# EasyEDA Pro project ProPrj_fallctf2025badge_2025-09-24.epro, board PCB20
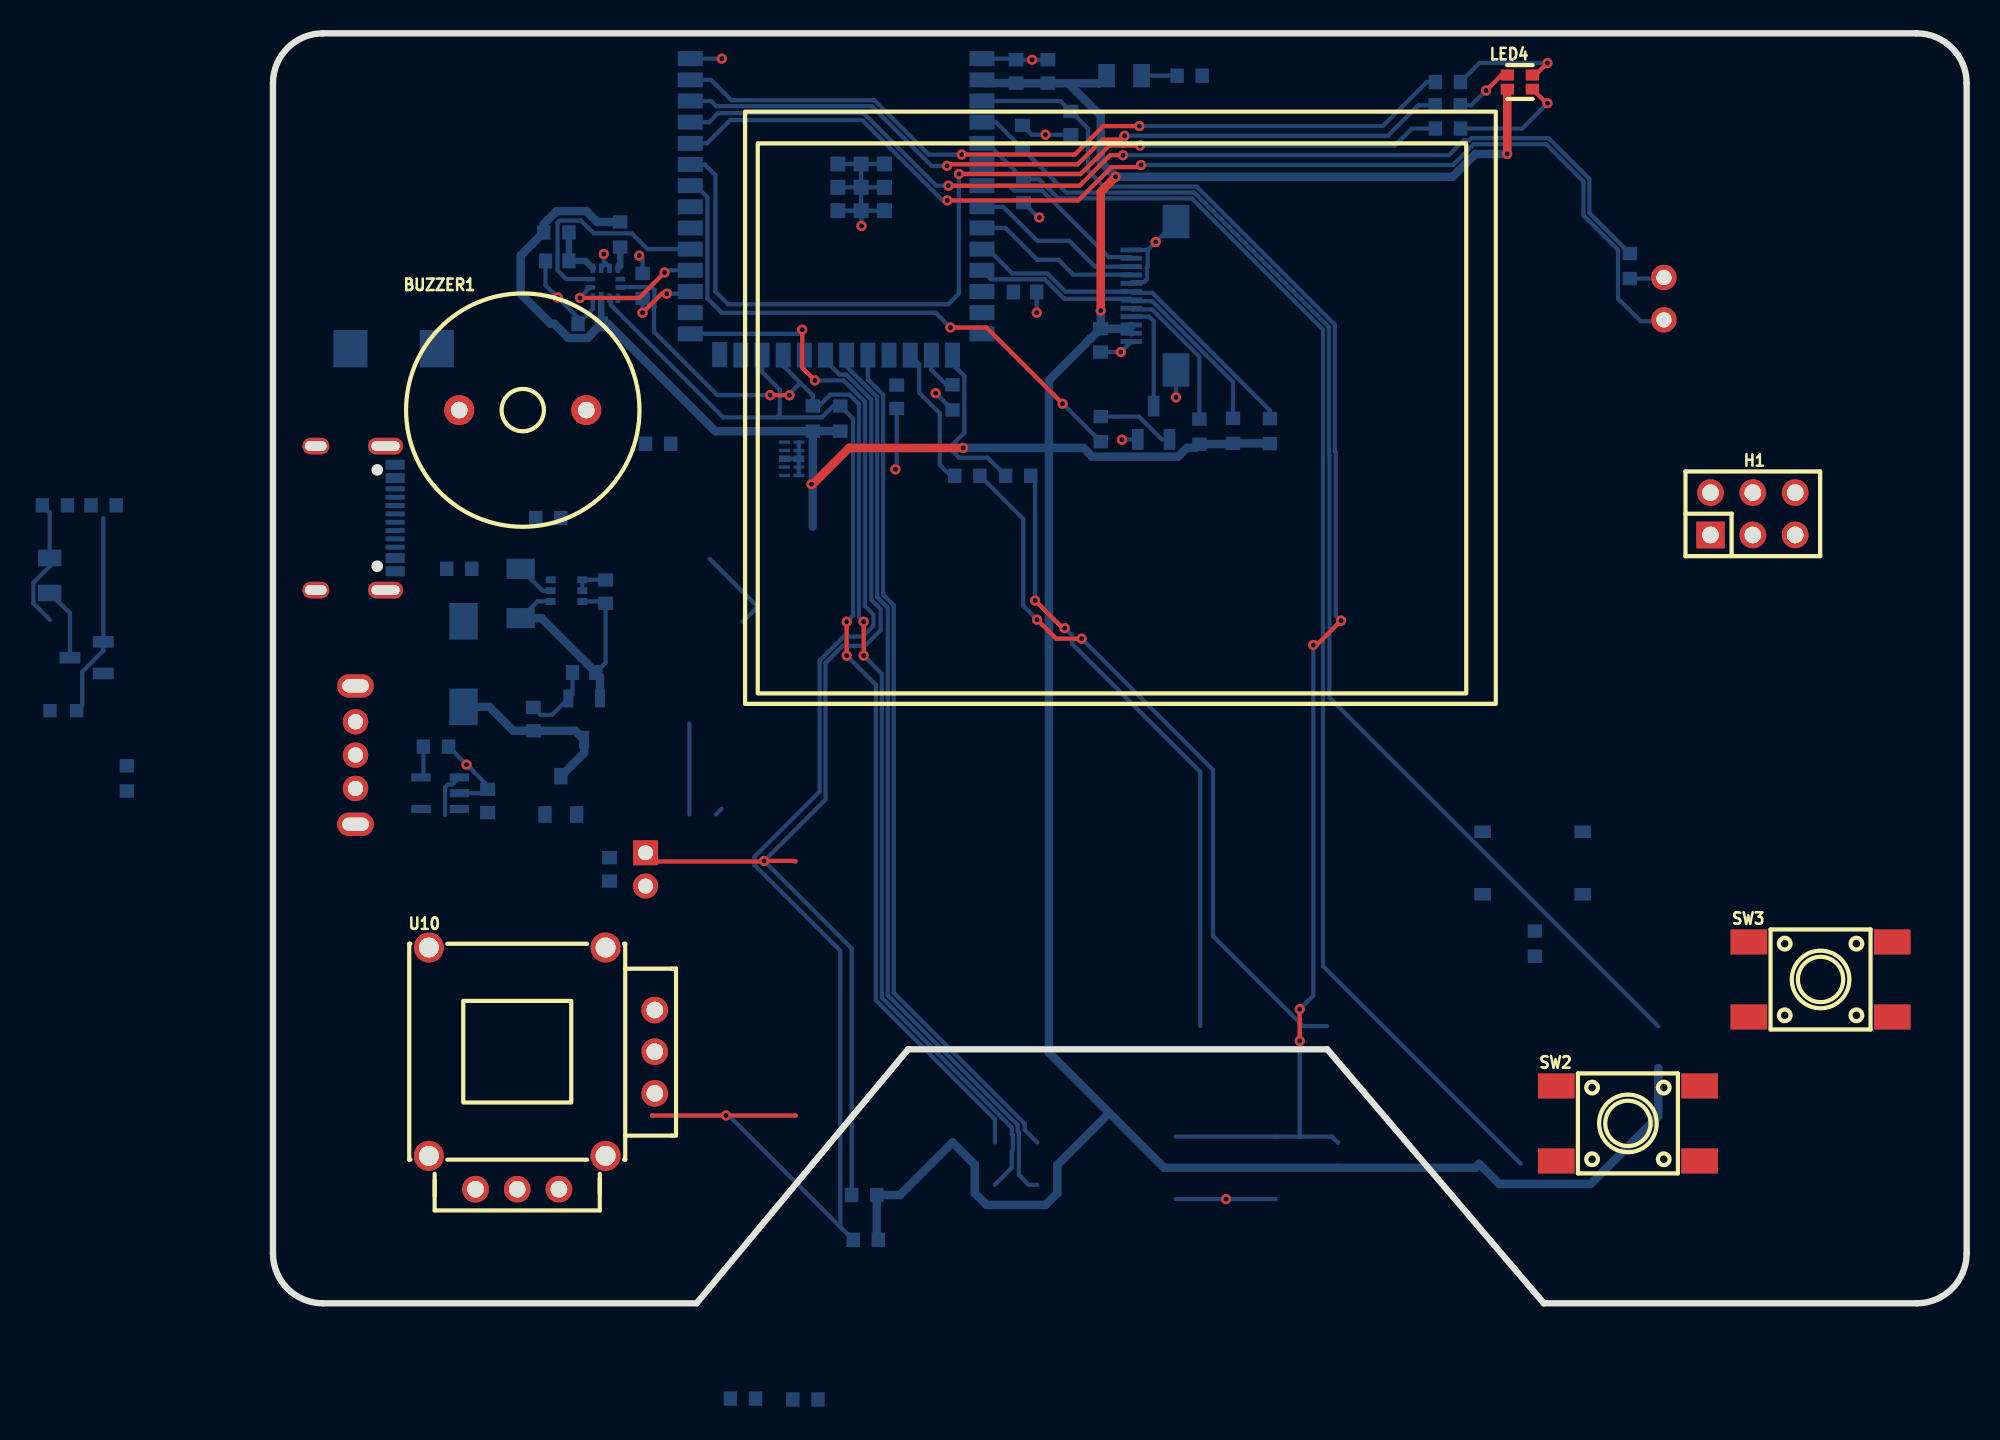
[diagram p15: board, top side]
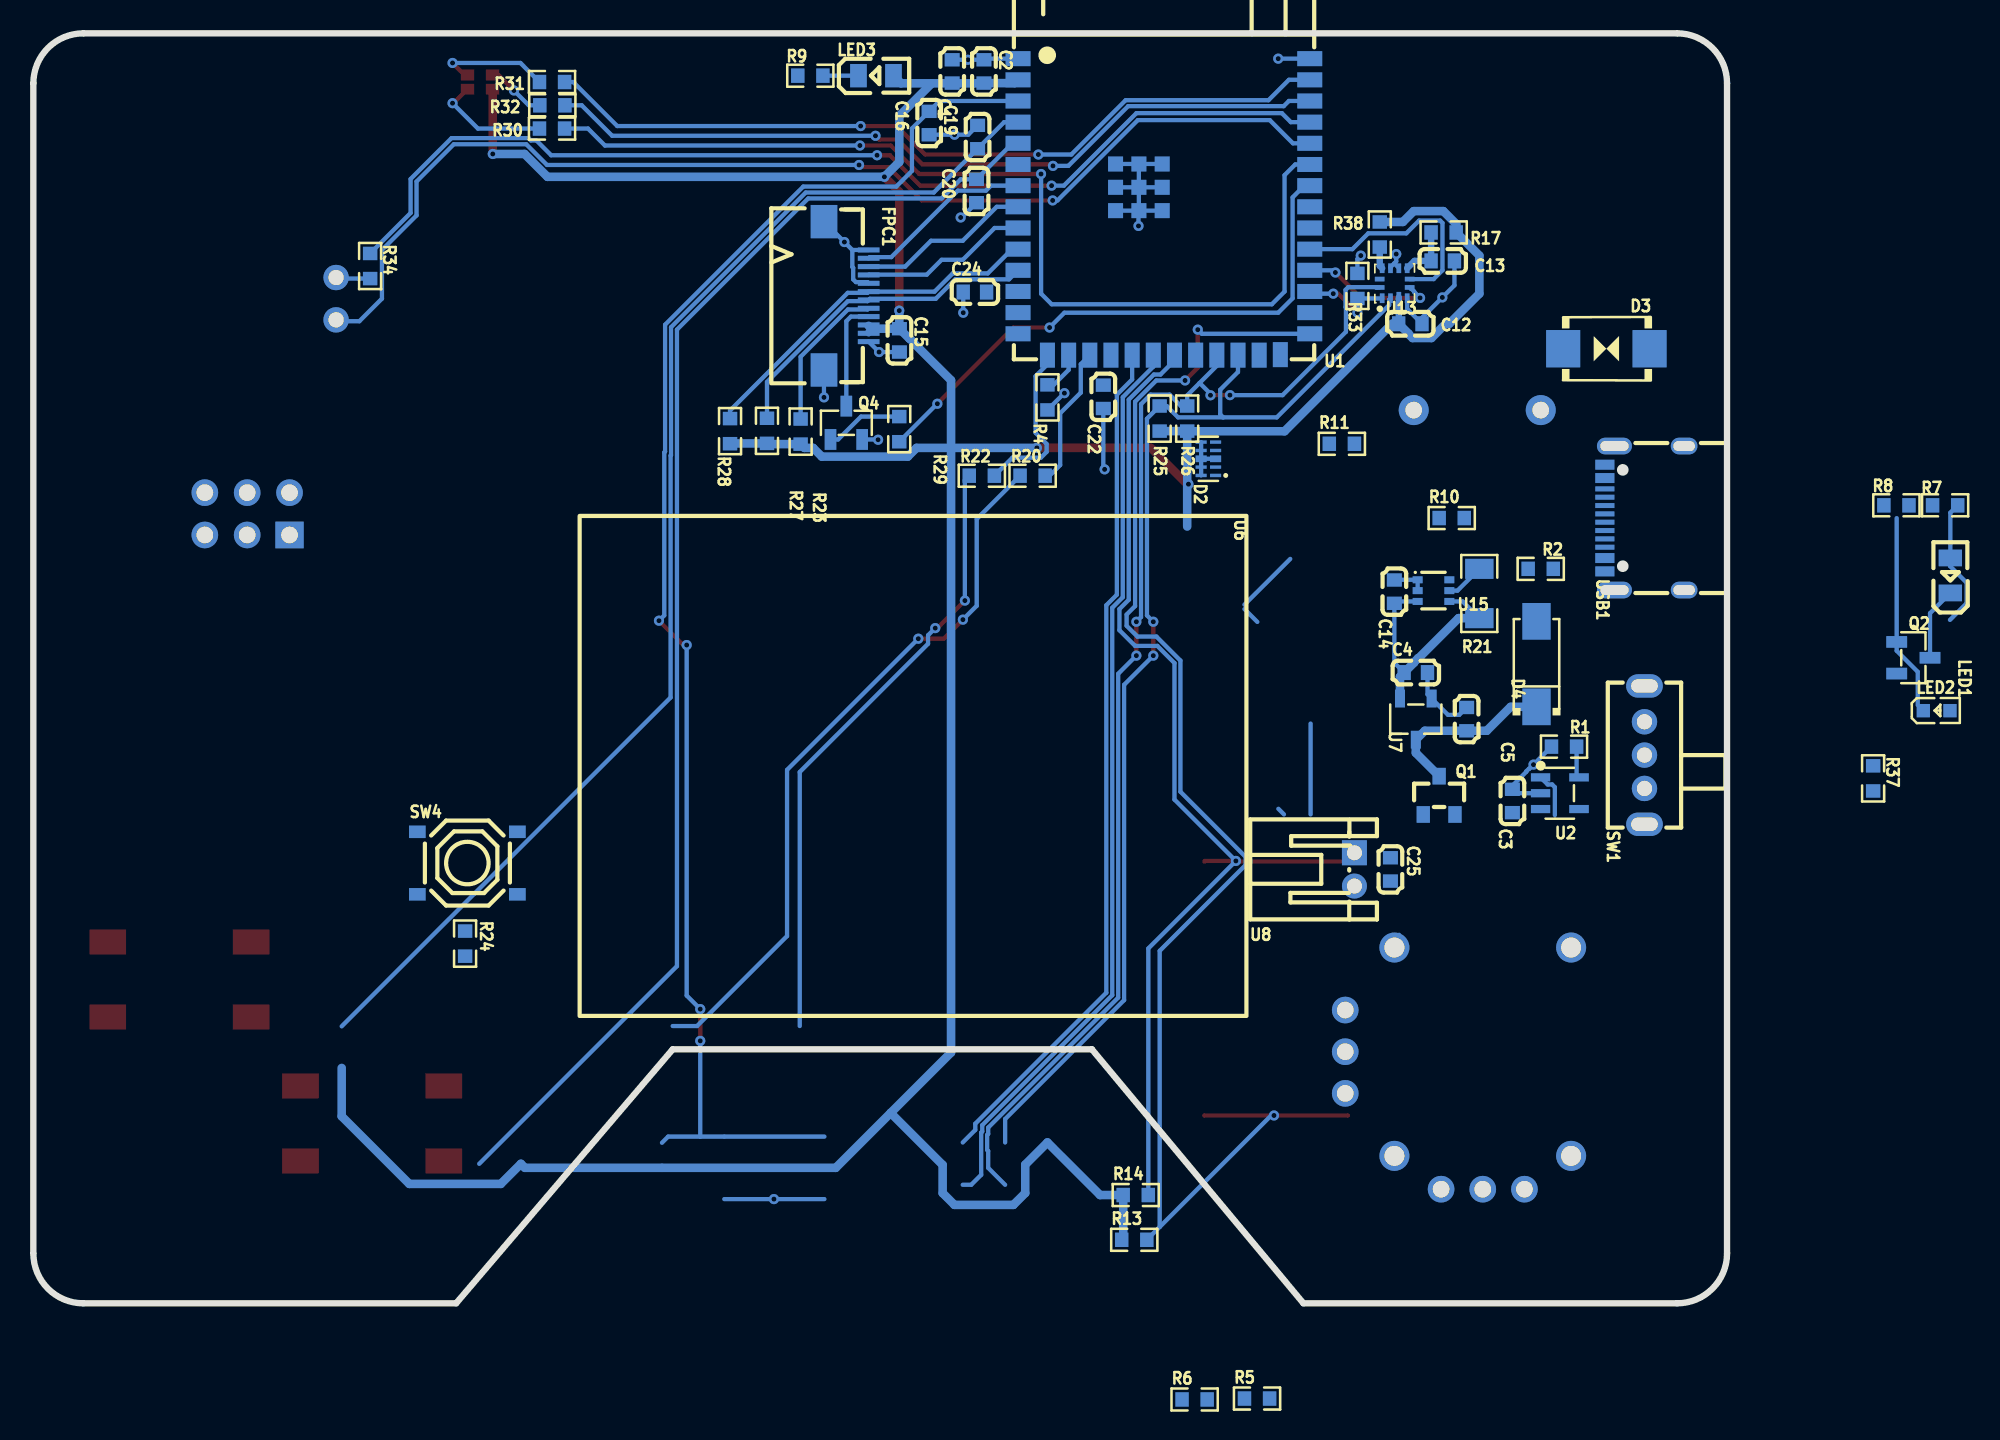
[diagram p16: board, bottom side, seen from below]

Outline 101.6 x 76.2 mm; copper layers: Top Layer, Bottom Layer. Coordinates in mm from the lower left corner of the outline.
Outline path: 0,73.2 0,3 arc(0.88,0.88) 3,0 25.41,0 38.1,15.24 63.25,15.24 76.24,0 98.6,0 arc(100.72,0.88) 101.6,3 101.6,73.2 arc(100.72,75.32) 98.6,76.2 3,76.2 arc(0.88,75.32) 0,73.2
Stack: Top Layer 0.035mm / Dielectric1 1.51mm FR4 er 4.5 / Bottom Layer 0.035mm

## Design rules (mm)
net D+: DP1
net D-: DP1
template: Custom Config
spacing copperThickness1oz (default): track to track 0.102, other pairs 0.152 to 0.3
spacing copperThickness2oz: track to track 0.203, other pairs 0.152 to 0.3
track width copperThickness1oz (default): min 0.127, default 0.254, max 2.54
track width copperThickness2oz: min 0.203, default 0.254, max 2.54
differential pair differentialPair (default): width min 0.127, default 0.254, max 2.54; gap min 0.152, default 0.152
via viaSize (default): diameter min 0.45, default 0.61, max 10; hole min 0.3, default 0.305, max 6.3

## Placement (name value [footprint] x y rotation side)
BUZZER1  4kHz  [BUZ-TH_BD14.0-P7.60-D0.7]  14.99 53.59 180 top
C1  22uF  [C0603]  46.48 73.91 90 bottom
C2  100nF  [C0603]  44.58 73.91 90 bottom
C3  1uF  [C0603]  12.88 30.14 90 bottom
C4  1uF  [C0603]  18.67 37.85 180 bottom
C5  1uF  [C0603]  15.62 35.05 90 bottom
C12  1uF  [C0603]  19 58.77 180 bottom
C13  1uF  [C0603]  17.05 62.55 180 bottom
C14  100nF  [C0603]  19.96 42.7 90 bottom
C15  100nF  [C0603]  49.65 57.78 270 bottom
C16  1uF  [C0603]  47.86 70.82 270 bottom
C19  100nF  [C0603]  44.96 69.98 270 bottom
C20  100nF  [C0603]  45.02 66.74 90 bottom
C22  100nF  [C0603]  37.42 54.39 90 bottom
C24  100nF  [C0603]  45.12 60.68 180 bottom
C25  100nF  [C0603]  20.19 26.03 270 bottom
D2  H5VU25U  [DFN2510-10_L2.5-W1.0-P0.50-BL]  31.11 50.67 90 bottom
D3  P6SMB6.8CA/TR13  [SMB_L4.6-W3.6-LS5.3-BI]  7.24 57.28 180 bottom
D4  SS14  [SMA_L4.2-W2.6-LS5.3-RD]  11.43 38.35 90 bottom
FPC1  AFC01-S12FCA-00  [FPC-SMD_AFC01-S12FCA-00]  52.83 60.45 270 bottom
H1  PM2.54-2*3  [HDR-TH_6P-P2.54-V-F-R2-C3-S2.54]  88.77 47.37 0 top
LED1  KT-0805G  [LED0805-R-RD]  -13.39 43.67 90 bottom
LED2  KT-0603R  [LED0603-RD]  -12.57 35.56 180 bottom
LED3  KT-0805G  [LED0805-R-RD]  51.05 73.66 180 bottom
LED4  XL-1615RGBC-RF  [LED-ARRAY-SMD_4P-L1.6-W1.5-BR_XL-1615RGBC-RF]  74.8 73.28 180 top
Q1  AO3401A  [SOT-23_L2.9-W1.3-P1.90-LS2.4-BR]  17.27 30.48 270 bottom
Q2  AO3400A  [SOT-23-3_L2.9-W1.3-P1.90-LS2.4-BR]  -11.18 38.73 0 bottom
Q4  AO3400A  [SOT-23-3_L2.9-W1.3-P1.90-LS2.4-BR]  52.83 52.83 270 bottom
R1  2.2K  [R0603]  9.78 33.4 0 bottom
R2  10K  [R0603]  11.18 44.07 180 bottom
R4  10K  [R0603]  40.77 54.36 90 bottom
R5  100K  [R0603]  28.19 -5.72 180 bottom
R6  100K  [R0603]  31.94 -5.77 180 bottom
R7  680  [R0603]  -13.08 47.88 0 bottom
R8  10K  [R0603]  -10.16 47.88 180 bottom
R9  680  [R0603]  54.99 73.66 180 bottom
R10  5K1  [R0603]  16.52 47.12 180 bottom
R11  5K1  [R0603]  23.11 51.57 180 bottom
R13  10K  [R0603]  35.56 3.81 180 bottom
R14  10K  [R0603]  35.47 6.5 180 bottom
R17  33  [R0603]  17 64.25 180 bottom
R20  220  [R0603]  41.66 49.66 0 bottom
R21  100mΩ  [R1206]  14.86 42.59 90 bottom
R22  220  [R0603]  44.7 49.66 0 bottom
R23  10  [R0603]  55.57 52.31 90 bottom
R24  10K  [R0603]  75.7 21.58 270 bottom
R25  5K1  [R0603]  34.04 53.09 270 bottom
R26  5K1  [R0603]  32.39 53.09 270 bottom
R27  10K  [R0603]  57.59 52.35 270 bottom
R28  10K  [R0603]  59.81 52.33 270 bottom
R29  220  [R0603]  49.66 52.45 90 bottom
R30  33  [R0603]  70.48 70.48 180 bottom
R31  33  [R0603]  70.48 73.28 180 bottom
R32  82  [R0603]  70.47 71.88 0 bottom
R33  10K  [R0603]  22.17 61.04 270 bottom
R34  33  [R0603]  81.4 62.24 270 bottom
R37  33  [R0603]  -8.76 31.5 270 bottom
R38  10K  [R0603]  20.83 64.13 90 bottom
SW1  SK12D07VG4  [SW-TH_SK12D07VG4]  4.95 32.89 90 bottom
SW2  TS-1102S-C-C-B  [KEY-SMD_4P-L6.0-W6.0-P4.50-LS8.6]  81.28 10.79 0 top
SW3  TS-1102S-C-C-B  [KEY-SMD_4P-L6.0-W6.0-P4.50-LS8.6]  92.84 19.43 0 top
SW4  TS-1187A-B-A-B  [SW-SMD_4P-L5.1-W5.1-P3.70-LS6.5-TL_H1.5]  75.57 26.42 0 bottom
U1  2.4GHz  [WIRELM-SMD_ESP32-S3-WROOM-1]  33.78 65.79 180 bottom
U2  TP4054-42-SOT25R  [SOT-23-5_L3.0-W1.7-P0.95-LS2.8-BL]  10.03 30.61 270 bottom
U3  -  [pad_THT]  83.44 61.55 180 bottom
U4  -  [pad_THT]  83.44 59.01 180 bottom
U6  Battery  [lipo_battery]  50.17 32.26 270 bottom
U7  XC6206P332MR-G  [SOT-23-3_L2.9-W1.6-P1.90-LS2.8-BR]  18.67 35.05 90 bottom
U8  S2B-PH-K(LF)(SN)  [CONN-TH_S2B-PH-K-LF-SN]  22.35 26.03 90 bottom
U10  YA13-FL7.4-B5Ka(45-10)-R-Y06  [RES-ADJ-TH_YA13-FL7.4-B5KA-45-10-R-Y06_1]  16.13 14.1 0 top
U13  STK8321  [LGA-12_L2.0-W2.0-P0.50-TR]  19.94 61.2 0 bottom
U15  INA199A1DCKR  [SC-70-6_L2.2-W1.3-P0.65-LS2.1-BR]  17.61 42.76 0 bottom
U16  DISPLAY  [ER-TFT018-3]  50.8 53.72 0 top
USB1  HC-TYPE-C-16P-01A-L  [USB-C-SMD_G-SWITCH_GT-USB-7010EN]  4.95 47.12 90 bottom

## Footprints (pads in the part's own frame, mm; a bottom-side part is the same pattern mirrored in y, then rotated)
BUZ-TH_BD14.0-P7.60-D0.7
  round 1.8 hole 1: 1(-3.81,0) 2(3.81,0)
C0603
  rect 0.8x0.9 smd: 1(-0.7,0) 2(0.7,0)
CONN-TH_S2B-PH-K-LF-SN
  rect 1.5x1.5 hole 0.9: 1(1,0)
  round 1.5 hole 0.9: 2(-1,0)
DFN2510-10_L2.5-W1.0-P0.50-BL
  rect 0.2x0.665 smd: 1(-1,-0.433) 2(-0.5,-0.433) 4(0.5,-0.433) 5(1,-0.433) 6(1,0.433) 7(0.5,0.433) 9(-0.5,0.433) 10(-1,0.433)
  rect 0.4x0.665 smd: 3(0,-0.433) 8(0,0.433)
FPC-SMD_AFC01-S12FCA-00
  rect 0.3x1.3 smd: 1(-2.751,1.341) 2(-2.251,1.341) 3(-1.751,1.341) 4(-1.25,1.341) 5(-0.75,1.341) 6(-0.249,1.341) 7(0.251,1.341) 8(0.75,1.341) 9(1.249,1.341) 10(1.75,1.341) 11(2.249,1.341) 12(2.75,1.341)
  rect 2x1.6 smd: 13(-4.45,-1.34) 14(4.45,-1.341)
HDR-TH_6P-P2.54-V-F-R2-C3-S2.54
  rect 1.7x1.6 hole 1: 1(-2.54,-1.27)
  round 1.6 hole 1: 2(-2.54,1.27) 3(0,-1.27) 4(0,1.27) 5(2.54,-1.27) 6(2.54,1.27)
KEY-SMD_4P-L6.0-W6.0-P4.50-LS8.6
  rect 2.2x1.5 smd: 1(-4.3,2.25) 2(4.3,2.25) 3(-4.3,-2.25) 4(4.3,-2.25)
LED0603-RD
  rect 0.8x0.8 smd: 1(-0.799,0) 2(0.799,0)
LED0805-R-RD
  rect 1x1.399 smd: 1(1.05,0) 2(-1.05,0)
LED-ARRAY-SMD_4P-L1.6-W1.5-BR_XL-1615RGBC-RF
  rect 0.8x0.65 smd: 1(0.75,-0.425) 2(0.75,0.425) 3(-0.75,0.425) 4(-0.75,-0.425)
LGA-12_L2.0-W2.0-P0.50-TR
  rect 0.28x0.58 smd: 1(0.75,0.9) 2(0.25,0.9) 4(-0.75,0.9) 7(-0.75,-0.9) 8(-0.25,-0.9) 9(0.25,-0.9) 10(0.75,-0.9)
  rect 0.28x0.67 smd: 3(-0.25,0.855)
  rect 0.58x0.28 smd: 5(-0.9,0.25) 6(-0.9,-0.25) 11(0.9,-0.25) 12(0.9,0.25)
pad_THT
  round 1.524 hole 0.914: 1(0,0)
R0603
  rect 0.806x0.864 smd: 1(-0.753,0) 2(0.753,0)
R1206
  rect 1.208x1.701 smd: 1(-1.479,0) 2(1.479,0)
RES-ADJ-TH_YA13-FL7.4-B5KA-45-10-R-Y06_1
  round 1.6 hole 1: 1(6.775,3.5) 2(6.775,1) 3(6.775,-1.5) 4(1.025,-7.25) 5(-1.475,-7.25) 6(-3.975,-7.25)
  round 1.8 hole 1.2: 7(3.825,7.25) 7(3.825,-5.25) 8(-6.775,7.25) 8(-6.775,-5.25)
SC-70-6_L2.2-W1.3-P0.65-LS2.1-BR
  rect 0.6x0.42 smd: 1(0.95,-0.65) 2(0.95,0) 3(0.95,0.65) 4(-0.95,0.65) 5(-0.95,0) 6(-0.95,-0.65)
SMA_L4.2-W2.6-LS5.3-RD
  rect 2.2x1.7 smd: 1(-2.566,0) 2(2.566,0)
SMB_L4.6-W3.6-LS5.3-BI
  rect 2.047x2.241 smd: 1(-2.591,0) 2(2.591,0)
SOT-23-3_L2.9-W1.3-P1.90-LS2.4-BR
  rect 1.25x0.7 smd: 1(1,-0.95) 2(1,0.95) 3(-1,0)
SOT-23-3_L2.9-W1.6-P1.90-LS2.8-BR
  rect 1.07x0.6 smd: 1(1.235,-0.95) 2(1.235,0.95) 3(-1.235,0)
SOT-23-5_L3.0-W1.7-P0.95-LS2.8-BL
  rect 0.49x1.157 smd: 1(-0.95,-1.153) 2(0,-1.153) 3(0.95,-1.153)
  rect 0.49x1.175 smd: 4(0.95,1.153) 5(-0.95,1.153)
SOT-23_L2.9-W1.3-P1.90-LS2.4-BR
  rect 1x0.8 smd: 1(1.15,-0.95) 2(1.15,0.95) 3(-1.15,0)
SW-SMD_4P-L5.1-W5.1-P3.70-LS6.5-TL_H1.5
  rect 1x0.75 smd: 1(-3,1.875) 2(3,1.875) 3(-3,-1.875) 4(3,-1.875)
SW-TH_SK12D07VG4
  round 1.524 hole 0.914: 1(-2,0) 2(0,0) 3(2,0)
  oval 1.4x2.2 hole 0.8x1.6: 4(4.15,0) 5(-4.15,0)
USB-C-SMD_G-SWITCH_GT-USB-7010EN
  oval 1x2.1 hole 0.6x1.7: 1(-4.32,1.802) 2(4.32,1.802)
  oval 1x1.6 hole 0.6x1.3: 3(4.32,-2.377) 4(-4.32,-2.377)
  rect 0.6x1.15 smd: A1B12(-3.2,2.377) A4B9(-2.4,2.377) B1A12(3.2,2.377) B4A9(2.4,2.377)
  rect 0.3x1.15 smd: A5(-1.25,2.377) A6(-0.25,2.377) A7(0.25,2.377) A8(1.25,2.377) B5(1.75,2.377) B6(0.75,2.377) B7(-0.75,2.377) B8(-1.75,2.377)
WIRELM-SMD_ESP32-S3-WROOM-1
  rect 1.5x0.9 smd: 1(-8.75,8.895) 2(-8.75,7.625) 3(-8.75,6.355) 4(-8.75,5.085) 5(-8.75,3.815) 6(-8.75,2.545) 7(-8.75,1.275) 8(-8.75,0.005) 9(-8.75,-1.265) 10(-8.75,-2.535) 11(-8.75,-3.805) 12(-8.75,-5.075) 13(-8.75,-6.345) 14(-8.75,-7.615) 27(8.75,-7.615) 28(8.75,-6.345) 29(8.75,-5.075) 30(8.75,-3.805) 31(8.75,-2.535) 32(8.75,-1.265) 33(8.75,0.005) 34(8.75,1.275) 35(8.75,2.545) 36(8.75,3.815) 37(8.75,5.085) 38(8.75,6.355) 39(8.75,7.625) 40(8.75,8.895)
  rect 0.9x1.5 smd: 15(-6.985,-8.895) 16(-5.715,-8.895) 17(-4.445,-8.895) 18(-3.175,-8.895) 19(-1.905,-8.895) 20(-0.635,-8.895) 21(0.635,-8.895) 22(1.905,-8.895) 23(3.175,-8.895) 24(4.445,-8.895) 25(5.715,-8.895) 26(6.985,-8.865)
  rect 0.9x0.9 smd: 41(-2.9,-0.225) 41(-2.9,1.175) 41(-2.9,2.575) 41(-1.5,-0.225) 41(-1.5,1.175) 41(-1.5,2.575) 41(-0.1,-0.225) 41(-0.1,1.175) 41(-0.1,2.575)

## Nets
As in the schematic.

Pads without a net: D2 1 5; U1 6 22 25 26 28 32 33; U13 11; USB1 A8 B8

## Via types
v1: diameter 0.61, hole 0.305, Top Layer to Bottom Layer, 59 vias

## Routing (per net, layer and track width the routed paths; a pad name or vN(x,y) marks a point on that pad's centre or on a via; arc(x,y) is an arc through that point)
+3.3V: length 239.1
  Top Layer w0.508: LED4.2 74.04,72.84 v1(74.04,68.96) ; v1(49.66,59.56) 49.66,66.7 v1(50.55,67.59) ; 32.39,49.15 34.56,51.33 v1(41.4,51.33)
  Bottom Layer w0.254: U15.5 16.17,42.76 R21.2 ; 51.49,58.31 51.32,58.48
  Bottom Layer w0.381: U13.3 19.69,58.78 ; FPC1.11 51.49,58.31
  Bottom Layer w0.508: C15.1 49.66,58.49 v1(49.66,59.56) ; C15.1 49.05,57.88 49.03,57.88 48.79,57.65 48.79,57.62 46.55,55.38 46.55,51.33 ; C15.1 51.32,58.48 51.49,58.65 ; 46.55,51.33 v1(41.4,51.33) ; 46.55,51.33 48.62,51.33 49.14,50.8 54.3,50.8 54.82,51.33 55.35,51.33 R23.1 57.55,51.55 R27.2 59.79,51.6 59.81,51.58 ; 46.55,51.33 46.55,15.04 50.17,11.42 ; R38.2 19.45,64.88 18.8,65.53 17.02,65.53 16.25,64.76 R17.2 14.86,62.87 14.86,60.58 16.66,58.77 16.87,58.77 17.73,57.92 18.87,57.92 19.11,58.16 19.11,58.18 C12.1 20.09,58.77 26.54,52.32 32.38,52.32 R26.2 ; 50.17,11.42 53.47,8.13 72.11,8.13 72.35,8.37 73.56,7.16 79.05,7.16 83.1,11.22 83.1,14.12 ; 50.17,11.42 47.05,8.3 47.05,6.61 46.35,5.91 42.81,5.91 42.1,6.61 42.1,8.32 40.77,9.65 37.61,6.5 R14.1 36.22,3.9 R13.1 ; 47.7,73.2 49.54,73.2 LED3.1 ; 47.7,73.2 49.66,71.25 49.66,68.48 v1(50.55,67.59) 70.76,67.59 72.13,68.96 v1(74.04,68.96) ; 47.7,73.2 44.59,73.2 44.57,73.21 42.73,73.21 U1.2 ; 32.39,46.61 R26.2 ; R26.2 R25.2
  vias: v1(32.31,49.15)
GND: length 69.4
  Bottom Layer w0.254: U1.41 U1.41 ; U1.41 U1.41 ; U1.41 U1.41 ; C14.2 19.95,43.41 U15.1 U15.2 ; v1(21.97,62.86) 22.17,62.66 R33.1 ; U2.2 12.64,30.61 C3.2 12.88,31.06 12.04,31.89 12.04,31.92 11.88,32.08 11.85,32.08 v1(11.61,32.32) R1.2 ; U1.41 U1.41 ; U1.41 U1.41 ; U1.41 U1.41 ; U1.41 35.31,65.54 v1(35.31,64.64) ; U1.41 U1.41 ; U1.41 U1.41 ; C16.2 v1(46.34,70.12) 45.52,70.12 C19.1 ; v1(37.34,50.04) 37.42,50.12 C22.1 ; D2.8 D2.3 ; D2.8 D2.7 D2.6 ; D2.8 D2.9 D2.10 ; v1(19.84,62.96) 19.84,62.51 19.97,62.39 ; 52.47,63.2 52.47,62.18 52.42,62.13 52.42,61.44 52.26,61.27 51.56,61.27 FPC1.5 ; 52.47,63.2 v1(52.95,63.68) FPC1.13 ; 52.47,63.2 FPC1.1 ; U13.4 19.19,59.66 C12.2 18.3,59.13 v1(17.08,60.35) 16.35,61.08 C13.2 ; U1.40 v1(26.92,74.68) ; 54.15,6.25 v1(57.17,6.25) 60.15,6.25 ; U13.8 19.69,62.13 19.95,62.39 19.97,62.39 ; FPC1.14 v1(54.17,54.36) ; v1(50.93,51.82) 50.94,51.83 Q4.2 ; C4.2 17.97,36.54 16.74,35.31 16.07,35.31 C5.2 ; FPC1.12 v1(50.87,57.08) C15.2 ; U1.1 44.51,74.68 C2.2 v1(45.54,74.61) C1.2 ; R4.1 39.76,54.61 v1(39.75,54.61) ; 19.97,62.39 20.19,62.17 U13.9 ; C24.1 v1(45.82,59.44) ; C20.1 45.91,65.15 v1(45.97,65.15)
ACCEL1: length 8.2
  Top Layer w0.254: v1(18.42,60.32) 21.97,60.32 v1(23.5,61.85)
  Bottom Layer w0.254: U13.5 18.96,60.87 18.93,60.87 18.77,60.71 18.77,60.68 18.42,60.33 v1(18.42,60.32) ; U1.30 23.63,61.98 v1(23.5,61.85)
ACCEL2: length 13.8
  Bottom Layer w0.254: U13.6 17.6,61.45 17.07,61.98 17.07,64.82 17.21,64.96 18.47,64.96 19.24,64.2 21.52,64.2 22.47,63.25 U1.31
ACCEL_SA0: length 5.7
  Top Layer w0.254: v1(22.17,59.44) 23.32,60.58 v1(23.62,60.58)
  Bottom Layer w0.254: U13.1 20.7,60.29 R33.2 v1(22.17,59.44) ; v1(23.62,60.58) 24.9,60.58 U1.29
BACKLT: length 6.6
  Bottom Layer w0.254: FPC1.9 52.56,59.2 52.83,58.93 Q4.3
BTN0: length 88.5
  Top Layer w0.254: v1(31.75,58.42) 31.75,56.13 v1(32.51,55.37) ; 31.35,11.27 31.35,11.27 v1(27.18,11.27) 22.75,11.27 22.75,11.27
  Bottom Layer w0.254: 34.03,4.58 27.35,11.27 v1(27.18,11.27) ; 34.03,4.58 34.03,21.15 28.88,26.3 28.88,26.78 32.79,30.7 32.79,38.57 34.23,40 35.37,40 36.02,40.65 36.02,41.33 35.51,41.83 35.51,54.1 34.24,55.37 v1(32.51,55.37) ; 34.03,4.58 R13.2 ; v1(31.75,58.42) 31.5,58.17 U1.27
BTN1: length 66.5
  Top Layer w0.254: 22.75,26.51 29.43,26.51 v1(29.46,26.54) 31.32,26.54 31.35,26.51
  Bottom Layer w0.254: U1.21 33.15,56.57 33.99,55.73 34.38,55.73 35.89,54.22 35.89,42.21 36.45,41.66 36.45,40.39 35.51,39.45 34.17,39.45 33.15,38.42 33.15,30.23 v1(29.46,26.54) 34.72,21.29 R14.2
BUZZ: length 10.1
  Bottom Layer w0.254: U1.15 40.77,56.34 41.48,55.63 41.48,52.23 40.82,51.57 40.82,51.08 41.16,50.74 42.87,50.74 R22.1
BUZZVOL: length 8.5
  Bottom Layer w0.254: U1.17 38.77,56.35 38.77,54.64 40.01,53.4 40.01,50.29 40.64,49.66 R20.1
EN: length 88.1
  Top Layer w0.254: v1(62.41,39.5) 62.61,39.5 v1(64.07,40.96) ; v1(61.6,17.65) v1(61.6,15.75)
  Bottom Layer w0.254: v1(61.6,15.75) 61.6,10.01 61.6,10 ; 63.89,9.63 63.52,10 61.6,10 ; 61.6,10 54.15,10 ; v1(61.6,17.65) 62.41,18.47 v1(62.41,39.5) ; v1(64.07,40.96) 63.75,41.27 63.75,51.05 63.7,51.1 63.7,58.71 55.41,67.01 49.83,67.01 48.89,67.94 48.89,70.49 C16.1 47.24,72.14 U1.3
JS1: length 76
  Bottom Layer w0.254: 42.53,70.87 43.36,70.87 C19.2 47.58,66.65 55.27,66.65 63.35,58.57 63.35,50.89 63.37,50.86 63.37,36.35 83.1,16.62
JS2: length 80.1
  Bottom Layer w0.254: U1.5 42.86,69.6 C20.2 45.97,67.44 47.12,66.29 55.12,66.29 62.99,58.42 62.99,20.23 74.85,8.37
LCD_CMD: length 10.8
  Bottom Layer w0.254: FPC1.2 51.42,62.77 50.13,62.77 46.15,66.76 44.46,66.76 44.16,67.06 U1.7
LCD_CS: length 21.8
  Bottom Layer w0.254: U1.10 42.89,63.25 44.35,61.8 46.45,61.8 47.54,60.7 FPC1.6 51.56,60.63 52.75,60.63 59.81,53.57 R28.1
LCD_LED: length 34.5
  Top Layer w0.254: v1(40.64,58.55) 42.8,58.55 v1(47.37,53.97)
  Bottom Layer w0.254: R29.1 47.38,53.97 v1(47.37,53.97) ; U1.34 25.36,67.06 26.06,66.36 26.06,60.3 26.92,59.44 39.75,59.44 v1(40.64,58.55)
LCD_RST: length 20
  Bottom Layer w0.254: U1.11 43.07,61.44 46.3,61.44 47.47,60.27 51.42,60.27 FPC1.7 51.56,60.13 52.74,60.13 57.59,55.28 R27.1
LEDB: length 60.8
  Top Layer w0.254: v1(52.02,69.47) 50.17,69.47 48.46,67.76 v1(41.15,67.76)
  Bottom Layer w0.254: U1.35 25.9,68.33 26.54,67.69 26.54,60.71 27.31,59.94 40.51,59.94 41.15,60.58 41.15,67.76 v1(41.15,67.76) ; v1(52.02,69.47) 67.31,69.47 68.33,70.48 R30.2
LEDG: length 48.5
  Top Layer w0.254: v1(41.31,68.93) 48.1,68.93 49.81,70.64 v1(51.97,70.64)
  Bottom Layer w0.254: v1(41.31,68.93) 39.33,68.93 36.08,72.19 27.51,72.19 26.28,73.41 U1.39 ; R31.2 69.21,73.28 66.57,70.64 51.88,70.64
LEDR: length 47.8
  Top Layer w0.254: v1(51.08,70.05) 50.86,69.82 49.76,69.82 48.28,68.34 40.53,68.34 v1(40.44,68.25)
  Bottom Layer w0.254: v1(40.44,68.25) 39.51,68.25 35.93,71.83 26.59,71.83 26.28,72.14 U1.38 ; R32.1 68.71,71.88 66.88,70.05 v1(51.08,70.05)
NCHRG: length 20.2
  Bottom Layer w0.254: -11.44,35.89 -11.44,37.89 -10.18,39.15 Q2.1 -10.18,47.11 ; U2.1 10.76,31.13 10.49,31.13 10.33,30.97 10.33,29.3 ; 26.58,29.34 26.91,29.67 ; 19.68,22.11 19.68,21.84 ; 28.18,40.89 28.95,41.66 ; 26.2,44.66 28.95,41.92
PRE_3V3: length 15.6
  Bottom Layer w0.254: U15.4 15.86,42.11 R21.1 ; C4.1 19.96,38.43 C14.1 19.85,42.11 U15.3
  Bottom Layer w0.508: R21.1 16.1,41.11 18.51,38.7 18.54,38.7 18.78,38.46 18.78,38.44 C4.1 19.62,37.6 U7.2
SAO1: length 51.4
  Bottom Layer w0.254: 45.85,9.65 45.1,10.4 45.1,10.77 37.24,18.63 37.24,41.88 36.6,42.52 36.6,54.52 35.69,55.43 U1.19
SAO2: length 54.8
  Bottom Layer w0.254: 45.85,7.11 45.34,7.11 44.74,7.71 44.74,10.25 44.68,10.31 44.68,10.69 36.88,18.49 36.88,41.73 36.25,42.37 36.25,54.37 34.42,56.2 U1.20
SCL: length 73.5
  Top Layer w0.254: v1(29.82,54.49) 30.98,54.49 v1(30.99,54.48) ; v1(35.43,40.89) v1(35.43,38.86)
  Bottom Layer w0.254: v1(29.82,54.49) 26.66,54.49 22.86,58.29 22.86,59.75 22.89,59.77 22.89,60.81 22.72,60.97 21.02,60.97 21,60.95 U13.12 ; 31.64,55.22 30.61,56.25 U1.23 ; 31.64,55.22 30.99,54.57 v1(30.99,54.48) ; 31.64,55.22 32.39,54.47 R26.1 32.76,53.84 33.44,54.52 34.58,54.52 35.15,53.95 35.15,41.17 v1(35.43,40.89) ; 43.31,7.11 44.32,8.13 44.32,9.14 44.39,9.2 44.39,10.1 44.32,10.16 44.32,10.54 36.52,18.34 36.52,37.77 v1(35.43,38.86)
SCL2: length 10.4
  Bottom Layer w0.254: U1.8 43.81,65.79 45.85,63.75 47.75,63.75 49.3,62.2 FPC1.3
SDA: length 69.9
  Top Layer w0.254: v1(34.42,40.89) v1(34.42,38.86)
  Bottom Layer w0.254: U13.2 20.27,60.22 20.27,59.9 27.01,53.16 30.23,53.16 ; U1.24 29.34,55.88 30.4,54.81 30.4,53.33 30.23,53.16 ; 30.23,53.16 32.93,53.16 33.61,53.84 R25.1 34.8,53.08 34.8,41.27 v1(34.42,40.89) ; 43.31,9.65 43.31,11.05 36.17,18.19 36.17,37.11 v1(34.42,38.86)
SDA2: length 10.1
  Bottom Layer w0.254: FPC1.4 51.47,61.72 48.01,61.72 47.12,62.61 45.85,62.61 43.94,64.52 U1.9
$1N22902: length 1.9
  Bottom Layer w0.254: U2.5 9.03,31.7 R1.1
$1N23592: length 2.5
  Bottom Layer w0.254: R4.2 40.39,55.11 39.5,56.01 U1.16
$1N41964: length 69.7
  Top Layer w0.254: v1(40.46,66.17) 48.31,66.17 50.31,68.17 51.94,68.17 v1(52.07,68.3)
  Bottom Layer w0.254: v1(52.07,68.3) 70.79,68.3 72.03,69.54 76.38,69.54 78.61,67.31 78.61,65.27 80.69,63.2 80.69,60.28 82.04,58.93 83.36,58.93 U4.1 ; v1(40.46,66.17) 40.16,66.17 35.34,70.99 27.43,70.99 26.04,69.6 U1.36
$1N50730: length 13.3
  Bottom Layer w0.254: 24.98,29.34 24.98,34.78 ; R7.1 -13.39,47.44 -13.39,44.72 -13.37,44.7 -13.37,44.24 -14.37,43.24 -14.37,42.01 -13.37,41.01
$1N50901: length 4.4
  Bottom Layer w0.254: LED1.2 -12.18,41.4 Q2.3
$1N51117: length 2.1
  Bottom Layer w0.254: LED3.2 R9.2
$1N58343: length 63.6
  Top Layer w0.254: v1(50.99,68.88) 50.22,68.89 48.39,67.06 40.53,67.06 v1(40.52,67.06)
  Bottom Layer w0.254: 25.03,70.87 26.17,70.87 26.71,71.41 35.43,71.41 39.78,67.06 v1(40.52,67.06) ; v1(50.99,68.88) 70.54,68.88 71.42,69.77 71.76,69.77 71.9,69.91 76.51,69.91 78.97,67.46 78.97,65.42 R34.1
$1N58369: length 2.1
  Bottom Layer w0.254: 81.4,61.49 83.38,61.49 U3.1
$1N59516: length 10.8
  Bottom Layer w0.508: D4.1 12.98,35.79 14.42,34.35 C5.1 18.13,34.35 U7.3 18.67,33.03 Q1.3
$2N18802: length 3.3
  Bottom Layer w0.381: U13.7 18.75,62.55 C13.1 17.75,64.25
$2N23538: length 1.3
  Bottom Layer w0.381: U13.10 20.83,62.25 R38.1
$3N653: length 6.9
  Top Layer w0.254: v1(76.45,74.42) 75.74,73.7 LED4.4
  Bottom Layer w0.254: v1(76.45,74.42) 72.38,74.42 R31.1
$3N657: length 7.1
  Top Layer w0.254: v1(76.45,72.01) 76.4,72.01 LED4.3
  Bottom Layer w0.254: v1(76.45,72.01) 74.93,70.48 R30.1
$3N662: length 3.6
  Top Layer w0.254: LED4.1 73.7,73.7 v1(72.77,72.77)
  Bottom Layer w0.254: 71.22,71.88 71.88,71.88 v1(72.77,72.77)
$3N4890: length 37.3
  Top Layer w0.254: v1(47.5,40.51) 47.37,40.51 v1(45.72,42.16)
  Bottom Layer w0.254: 55.63,16.64 55.63,31.88 47.93,39.57 47.93,40.08 v1(47.5,40.51) ; v1(45.72,42.16) 45.72,49.39 R22.2
$3N9217: length 9
  Bottom Layer w0.254: R23.2 55.57,56.8 52.74,59.63 51.56,59.63 FPC1.8
$3N9223: length 4.7
  Bottom Layer w0.254: R29.2 51.95,53.2 53.32,51.83 Q4.1
$3N12560: length 43.4
  Top Layer w0.254: v1(48.51,39.88) 46.98,39.88 v1(45.84,41.02)
  Bottom Layer w0.254: v1(45.84,41.02) 45.01,41.85 45.01,47.06 R20.2 ; v1(48.51,39.88) 56.39,32 56.39,22.03 61.79,16.64 63.25,16.64
